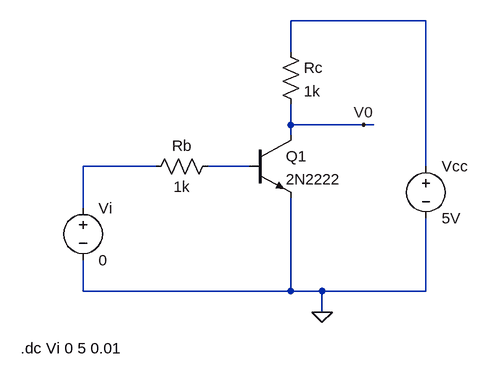
[diagram p0: schematic 1.2.1.asc]
1.2.1.asc, the LTspice schematic file:
Version 4
SHEET 1 880 680
WIRE 448 -80 240 -80
WIRE 240 -32 240 -80
WIRE 240 80 240 48
WIRE 352 80 240 80
WIRE 368 80 352 80
WIRE 240 96 240 80
WIRE 32 144 -80 144
WIRE 176 144 112 144
WIRE 448 144 448 -80
WIRE -80 208 -80 144
WIRE -80 336 -80 288
WIRE 240 336 240 192
WIRE 240 336 -80 336
WIRE 288 336 240 336
WIRE 448 336 448 224
WIRE 448 336 288 336
WIRE 288 368 288 336
FLAG 352 80 V0
FLAG 288 368 0
SYMBOL npn 176 96 R0
SYMATTR InstName Q1
SYMATTR Value 2N2222
SYMBOL res 224 -48 R0
SYMATTR InstName Rc
SYMATTR Value 1k
SYMBOL res 128 128 R90
WINDOW 0 0 56 VBottom 2
WINDOW 3 32 56 VTop 2
SYMATTR InstName Rb
SYMATTR Value 1k
SYMBOL voltage -80 192 R0
SYMATTR InstName Vi
SYMATTR Value 0
SYMBOL voltage 448 128 R0
SYMATTR InstName Vcc
SYMATTR Value 5V
TEXT -176 424 Left 2 !.dc Vi 0 5 0.01

The netlist it stands for:
* 1.2.1.asc
Q1 V0 N003 0 0 2N2222
Rc N001 V0 1k
Rb N003 N002 1k
Vi N002 0 0
Vcc N001 0 5V
.model NPN NPN
.model PNP PNP
.lib standard.bjt
.dc Vi 0 5 0.01
.backanno
.end